# Altium schematic sheet sch_USB3.0.SchDoc
size A4
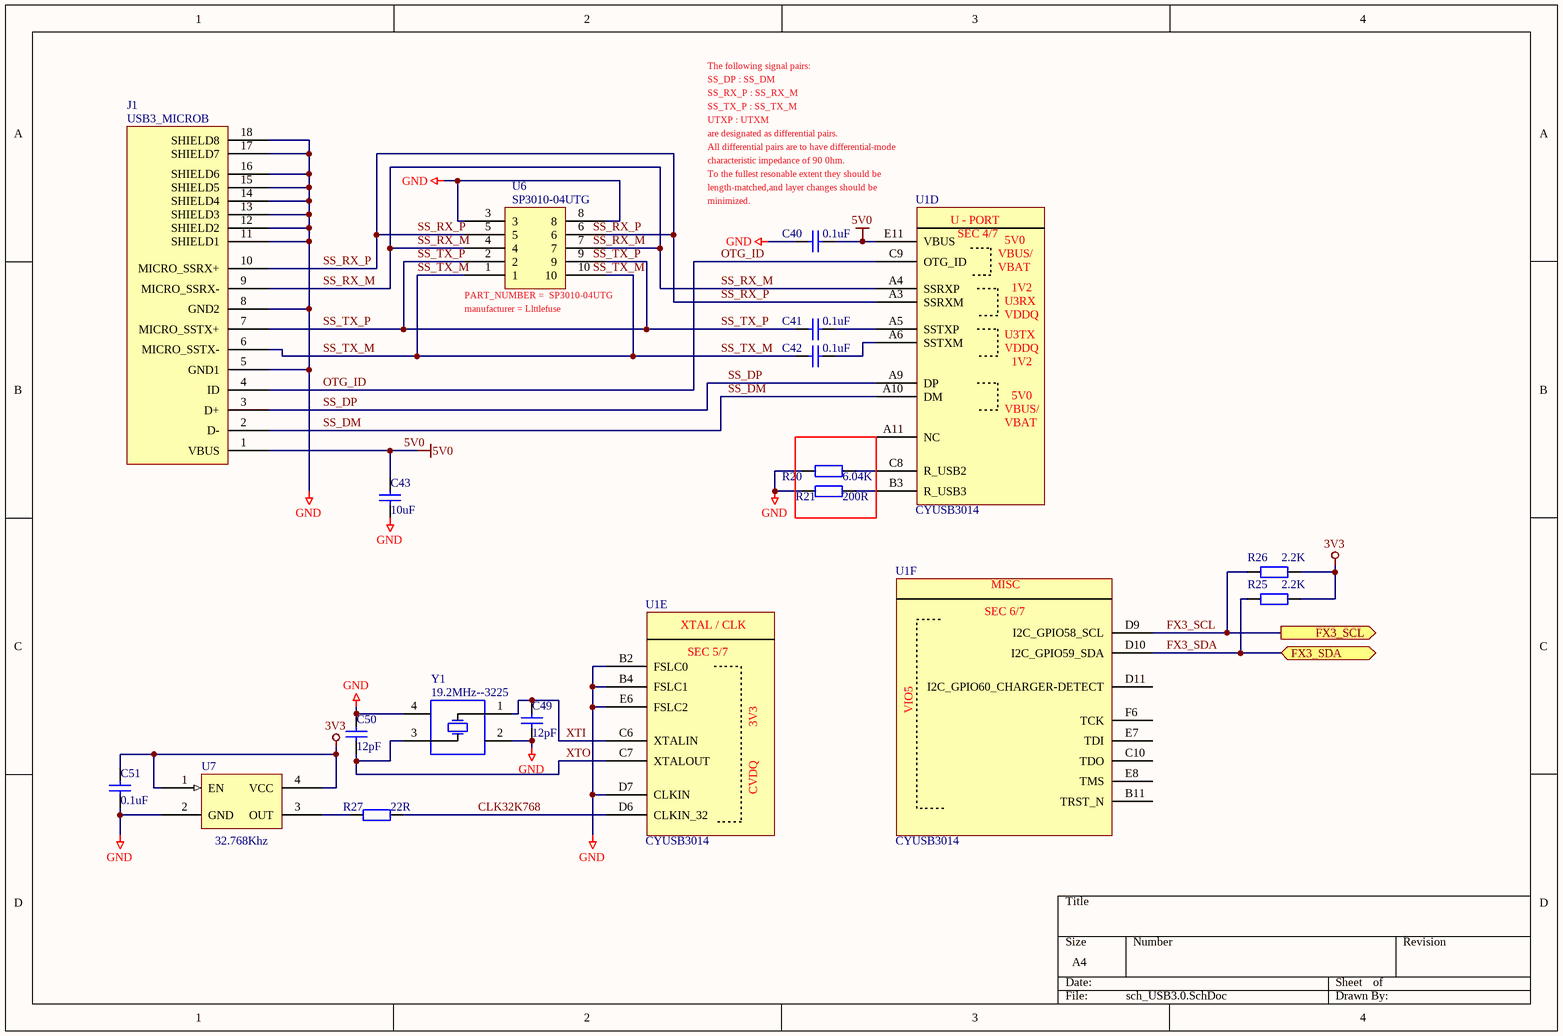
[diagram p0: sch_USB3.0.SchDoc]

## Parts
C40  0.1uF  [0402C]
C41  0.1uF  [0402C]
C42  0.1uF  [0402C]
C43  10uF  [0805C]
C49  12pF  [0402C]
C50  12pF  [0402C]
C51  0.1uF  [0402C]
J1  USB3_MICROB  [USB3_BA_P65L130W51H28]
R20  6.04K  [0402R]
R21  200R  [0402R]
R25  2.2K  [0402R]
R26  2.2K  [0402R]
R27  22R  [0402R]
U1  CYUSB3014  [FBGA121_P80L100W100H11]  (parts D,E,F of 7)
U6  SP3010-04UTG  [UDFN10_SON_P50L25W10H55]
U7  XTAL-3225  [XTAL_3225]  (value not drawn)
Y1  19.2MHz--3225  [XTAL_3225]

## Ports
FX3_SCL (out), FX3_SDA (bidir)

## Nets
3V3: C51.2 R25.1 R26.1 U7.1(EN) U7.4(VCC)
5V0: C40.1 C43.2 J1.1(VBUS) U1.E11(VBUS)
GND: C40.2 C43.1 C49.1 C50.2 C51.1 J1.5(GND1) J1.8(GND2) J1.11(SHIELD1) J1.12(SHIELD2) J1.13(SHIELD3) J1.14(SHIELD4) J1.15(SHIELD5) J1.16(SHIELD6) J1.17(SHIELD7) J1.18(SHIELD8) R20.2 R21.2 U1.B2(FSLC0) U1.B4(FSLC1) U1.D7(CLKIN) U1.E6(FSLC2) U6.3 U6.8 U7.2(GND) Y1.2 Y1.4
CLK32K768: R27.1 U1.D6(CLKIN_32)
FX3_SCL: R26.2 U1.D9(I2C_GPIO58_SCL) ; port FX3_SCL
FX3_SDA: R25.2 U1.D10(I2C_GPIO59_SDA) ; port FX3_SDA
OTG_ID: J1.4(ID) U1.C9(OTG_ID)
SS_DM: J1.2(D-) U1.A10(DM)
SS_DP: J1.3(D+) U1.A9(DP)
SS_RX_M: J1.9(MICRO_SSRX-) U1.A4(SSRXP) U6.4 U6.7
SS_RX_P: J1.10(MICRO_SSRX+) U1.A3(SSRXM) U6.5 U6.6
SS_TX_M: C42.2 J1.6(MICRO_SSTX-) U6.1 U6.10
SS_TX_P: C41.2 J1.7(MICRO_SSTX+) U6.2 U6.9
XTI: C49.2 U1.C6(XTALIN) Y1.1
XTO: C50.1 U1.C7(XTALOUT) Y1.3
NetC41_1: C41.1 U1.A5(SSTXP)
NetC42_1: C42.1 U1.A6(SSTXM)
NetR20_1: R20.1 U1.C8(R_USB2)
NetR21_1: R21.1 U1.B3(R_USB3)
NetR27_2: R27.2 U7.3(OUT)

Not connected (* = marked no-connect by the designer): U1 A11(NC) B11(TRST_N) C10(TDO) D11(I2C_GPIO60_CHARGER-DETECT) E7(TDI) E8(TMS) F6(TCK)

## Notes on the sheet
- The following signal pairs:
- SS_DP : SS_DM
- SS_RX_P : SS_RX_M
- SS_TX_P : SS_TX_M
- UTXP : UTXM
- are designated as differential pairs.
- All differential pairs are to have differential-mode
- characteristic impedance of 90 0hm.
- To the fullest resonable extent they should be
- length-matched,and layer changes should be
- minimized.
- (near U6) PART_NUMBER =  SP3010-04UTG
- (near U6) manufacturer = Llttlefuse
- (near U7) 32.768Khz
- Labels drawn without touching a wire or pin: SS_RX_M, SS_RX_P, SS_TX_M, SS_TX_P
- (in symbol CYUSB3014, part D) U - PORT; SEC 4/7; 5V0; VBUS/; 1V2; U3RX; VDDQ; U3TX
- (in symbol CYUSB3014, part E) XTAL / CLK; SEC 5/7; 3V3; CVDQ
- (in symbol CYUSB3014, part F) MISC; SEC 6/7

## Library data of the parts
C40-C43 C49-C51 = Cap: Capacitor; Published: 8-Jun-2000; LatestRevisionDate: 17-Jul-2002; LatestRevisionNote: Re-released for DXP Platform.; PackageReference: RAD-0.3; Publisher: Altium Limited
  C40-C42 C51: Value: 0.1uF
  C43: Value: 10uF
R20 = Resistor: Value: 43; Published: 8-Jun-2000; LatestRevisionDate: 17-Jul-2002; LatestRevisionNote: Re-released for DXP Platform.; PackageReference: AXIAL-0.4; Publisher: Altium Limited
R21 R25-R27 = Resistor: Published: 8-Jun-2000; LatestRevisionDate: 17-Jul-2002; LatestRevisionNote: Re-released for DXP Platform.; PackageReference: AXIAL-0.4; Publisher: Altium Limited
U7 = XTAL.
Y1 = XTAL: Crystal Oscillator